# EAGLE design Callisto_Header_Test_Board (EAGLE 9.6.2)
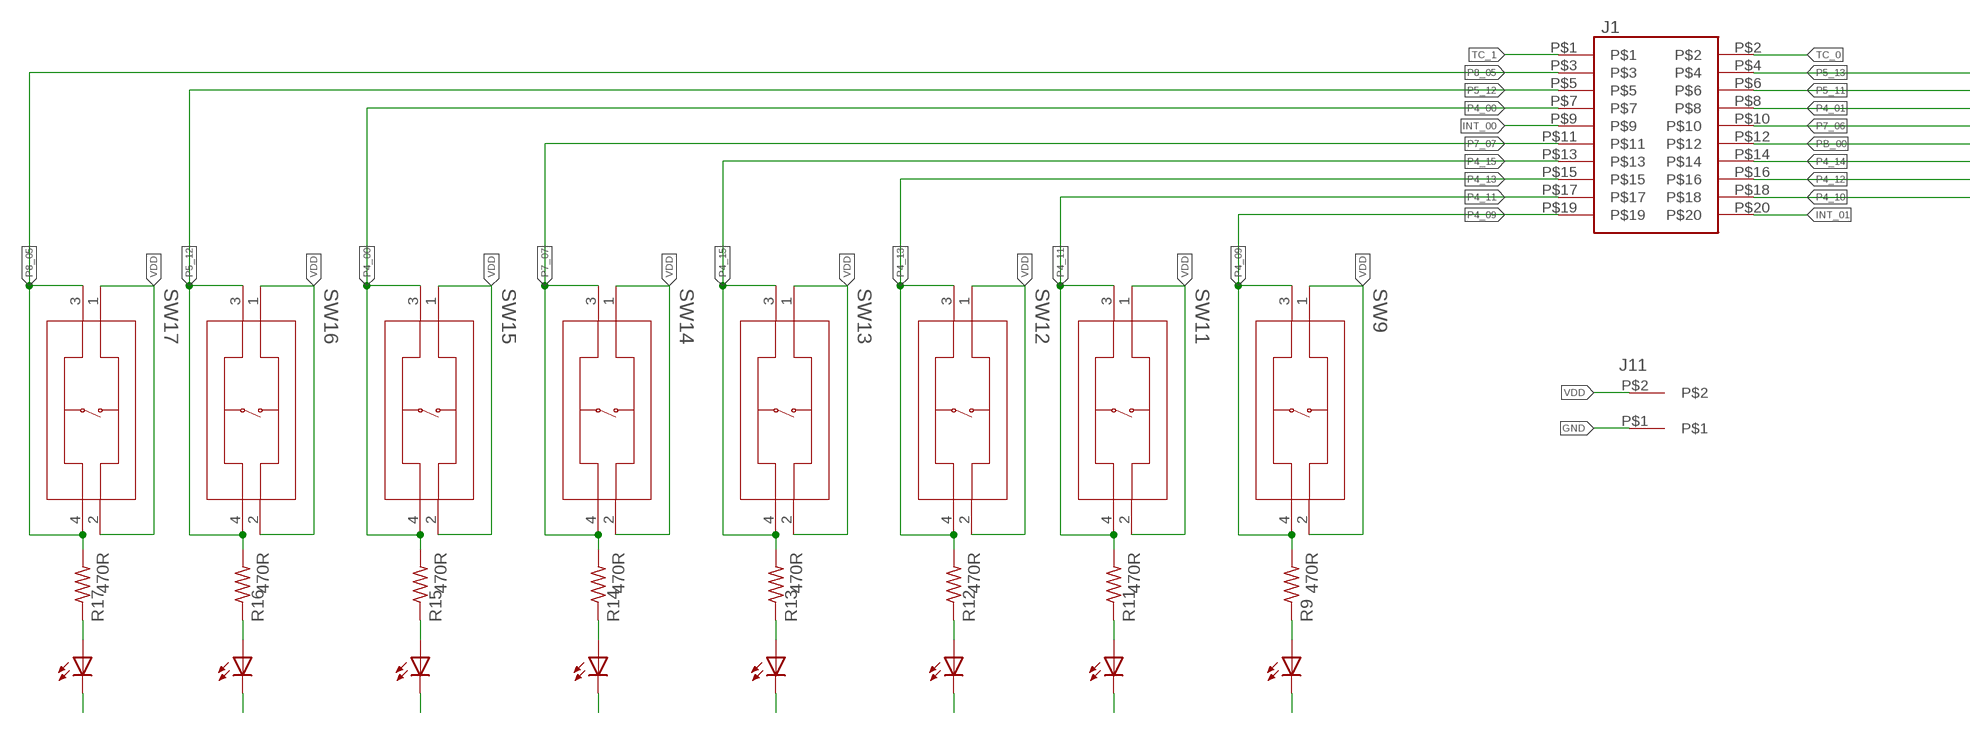
[diagram p0: schematic, sheet 1, part 1 of 2]
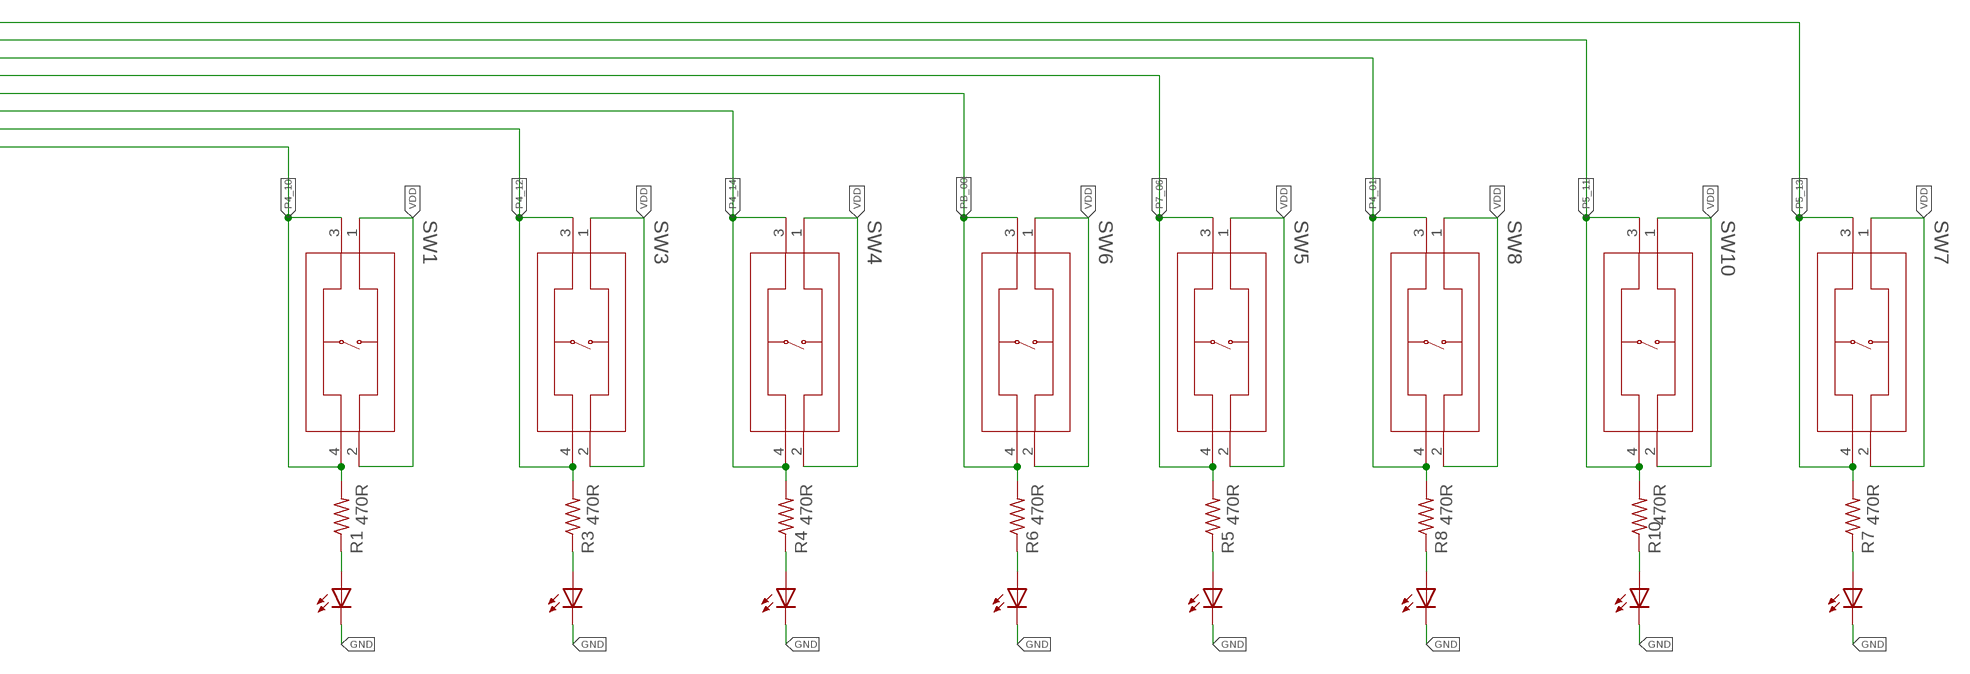
[diagram p1: schematic, sheet 1, part 2 of 2]

## Parts
J1  20-pos  2_X_10_HEADER_GENERIC  [2_X_10_.1_INCH]
J11  2-pos  3.81MM_1_X_2_RT_ANGLE_PLUG_HEADER  [2_3.81MM_PITCH]
LED1  Green  LED_0805_GREEN  [0805]
LED3  Green  LED_0805_GREEN  [0805]
LED4  Green  LED_0805_GREEN  [0805]
LED5  Green  LED_0805_GREEN  [0805]
LED6  Green  LED_0805_GREEN  [0805]
LED7  Green  LED_0805_GREEN  [0805]
LED8  Green  LED_0805_GREEN  [0805]
LED9  Green  LED_0805_GREEN  [0805]
LED10  Green  LED_0805_GREEN  [0805]
LED11  Green  LED_0805_GREEN  [0805]
LED12  Green  LED_0805_GREEN  [0805]
LED13  Green  LED_0805_GREEN  [0805]
LED14  Green  LED_0805_GREEN  [0805]
LED15  Green  LED_0805_GREEN  [0805]
LED16  Green  LED_0805_GREEN  [0805]
LED17  Green  LED_0805_GREEN  [0805]
R1  470R  R_0402  [0402]
R3  470R  R_0402  [0402]
R4  470R  R_0402  [0402]
R5  470R  R_0402  [0402]
R6  470R  R_0402  [0402]
R7  470R  R_0402  [0402]
R8  470R  R_0402  [0402]
R9  470R  R_0402  [0402]
R10  470R  R_0402  [0402]
R11  470R  R_0402  [0402]
R12  470R  R_0402  [0402]
R13  470R  R_0402  [0402]
R14  470R  R_0402  [0402]
R15  470R  R_0402  [0402]
R16  470R  R_0402  [0402]
R17  470R  R_0402  [0402]
SW1  PTS810SJG250SMTRLFS  [PTS810]
SW3  PTS810SJG250SMTRLFS  [PTS810]
SW4  PTS810SJG250SMTRLFS  [PTS810]
SW5  PTS810SJG250SMTRLFS  [PTS810]
SW6  PTS810SJG250SMTRLFS  [PTS810]
SW7  PTS810SJG250SMTRLFS  [PTS810]
SW8  PTS810SJG250SMTRLFS  [PTS810]
SW9  PTS810SJG250SMTRLFS  [PTS810]
SW10  PTS810SJG250SMTRLFS  [PTS810]
SW11  PTS810SJG250SMTRLFS  [PTS810]
SW12  PTS810SJG250SMTRLFS  [PTS810]
SW13  PTS810SJG250SMTRLFS  [PTS810]
SW14  PTS810SJG250SMTRLFS  [PTS810]
SW15  PTS810SJG250SMTRLFS  [PTS810]
SW16  PTS810SJG250SMTRLFS  [PTS810]
SW17  PTS810SJG250SMTRLFS  [PTS810]

## Nets
GND: J11.P$1 LED1.2(C) LED3.2(C) LED4.2(C) LED5.2(C) LED6.2(C) LED7.2(C) LED8.2(C) LED9.2(C) LED10.2(C) LED11.2(C) LED12.2(C) LED13.2(C) LED14.2(C) LED15.2(C) LED16.2(C) LED17.2(C)
INT_00: J1.P$9
INT_01: J1.P$20
N$1: LED1.1(A) R1.P$1
N$3: LED3.1(A) R3.P$1
N$4: LED4.1(A) R4.P$1
N$5: LED5.1(A) R5.P$1
N$6: LED6.1(A) R6.P$1
N$7: LED7.1(A) R7.P$1
N$8: LED8.1(A) R8.P$1
N$9: LED9.1(A) R9.P$1
N$10: LED10.1(A) R10.P$1
N$11: LED11.1(A) R11.P$1
N$12: LED12.1(A) R12.P$1
N$13: LED13.1(A) R13.P$1
N$14: LED14.1(A) R14.P$1
N$15: LED15.1(A) R15.P$1
N$16: LED16.1(A) R16.P$1
N$17: LED17.1(A) R17.P$1
P4_00: J1.P$7 R15.P$2 SW15.3 SW15.4
P4_01: J1.P$8 R8.P$2 SW8.3 SW8.4
P4_09: J1.P$19 R9.P$2 SW9.3 SW9.4
P4_10: J1.P$18 R1.P$2 SW1.3 SW1.4
P4_11: J1.P$17 R11.P$2 SW11.3 SW11.4
P4_12: J1.P$16 R3.P$2 SW3.3 SW3.4
P4_13: J1.P$15 R12.P$2 SW12.3 SW12.4
P4_14: J1.P$14 R4.P$2 SW4.3 SW4.4
P4_15: J1.P$13 R13.P$2 SW13.3 SW13.4
P5_11: J1.P$6 R10.P$2 SW10.3 SW10.4
P5_12: J1.P$5 R16.P$2 SW16.3 SW16.4
P5_13: J1.P$4 R7.P$2 SW7.3 SW7.4
P7_06: J1.P$10 R5.P$2 SW5.3 SW5.4
P7_07: J1.P$11 R14.P$2 SW14.3 SW14.4
P8_05: J1.P$3 R17.P$2 SW17.3 SW17.4
PB_00: J1.P$12 R6.P$2 SW6.3 SW6.4
TC_0: J1.P$2
TC_1: J1.P$1
VDD: J11.P$2 SW1.1 SW1.2 SW3.1 SW3.2 SW4.1 SW4.2 SW5.1 SW5.2 SW6.1 SW6.2 SW7.1 SW7.2 SW8.1 SW8.2 SW9.1 SW9.2 SW10.1 SW10.2 SW11.1 SW11.2 SW12.1 SW12.2 SW13.1 SW13.2 SW14.1 SW14.2 SW15.1 SW15.2 SW16.1 SW16.2 SW17.1 SW17.2

## Library data of the parts
J1 = 3D_MIG_Controller:2_X_10_HEADER_GENERIC: CONN HEADER R/A 20POS 2.54MM, Straight, Right Angle; PARTNO: 67996-420HLF
J11 = 3D_MIG_Controller:3.81MM_1_X_2_RT_ANGLE_PLUG_HEADER: TERM BLOCK HDR 2POS 90DEG 3.81MM; PARTNO: 691322310002
LED1 LED3-LED17 = 3D_MIG_Controller:LED_0805_GREEN: Green 570nm LED Indication - Discrete 2.2V 0805 (2012 Metric); PARTNO: LG R971-KN-1
R1 R3-R17 = 3D_MIG_Controller:R_0402
SW1 SW3-SW17 = 3D_MIG_Controller:PTS810SJG250SMTRLFS; BUILT_BY: EMA_Cory; COPYRIGHT: Copyright (C) 2018 Accelerated Designs. All rights reserved; DATASHEET: https://www.ckswitches.com/products/tactile/PTS810/#PTS810SJG250SMTRLFS; MANUFACTURER_PART_NUMBER: PTS810SJG250SMTRLFS; VENDOR: C&K

## Board
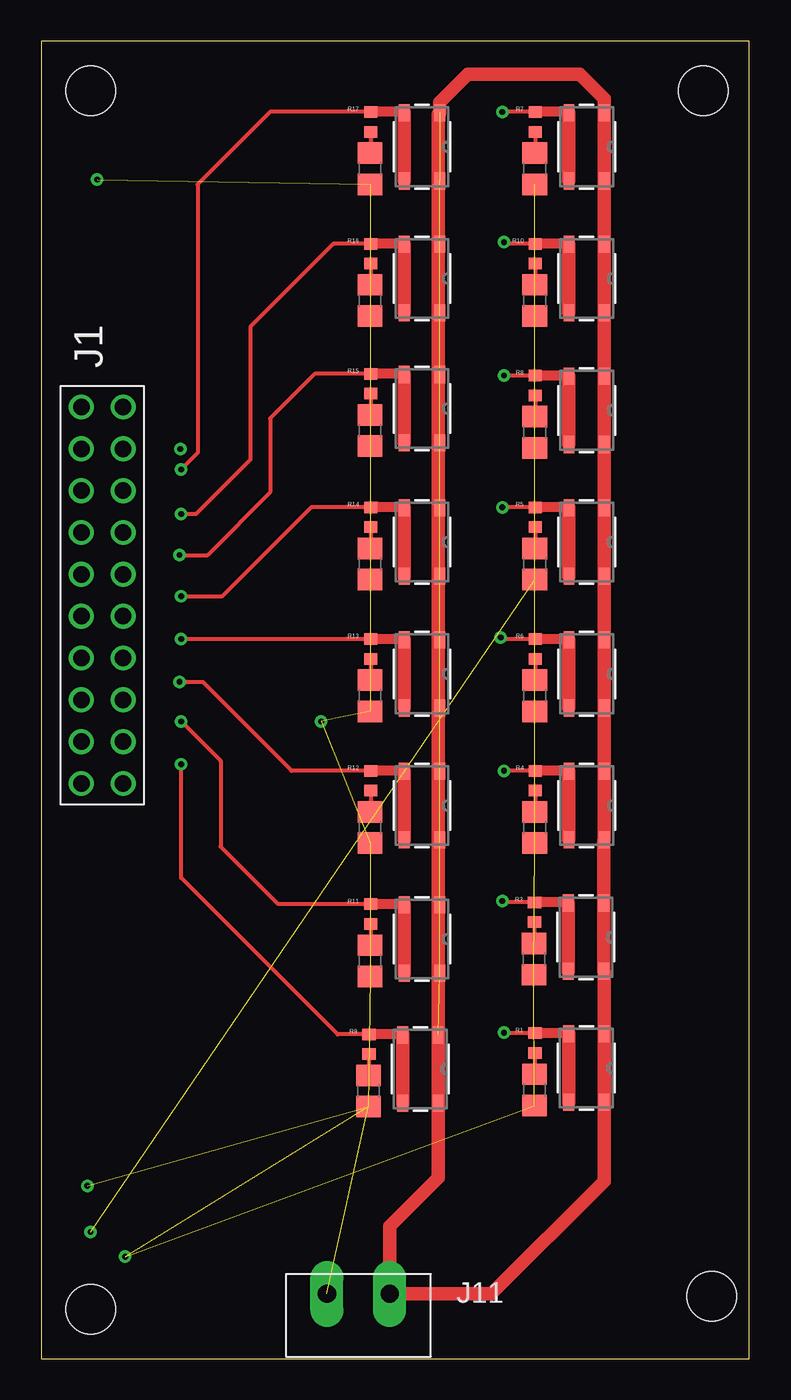
[diagram p2: board, top side]
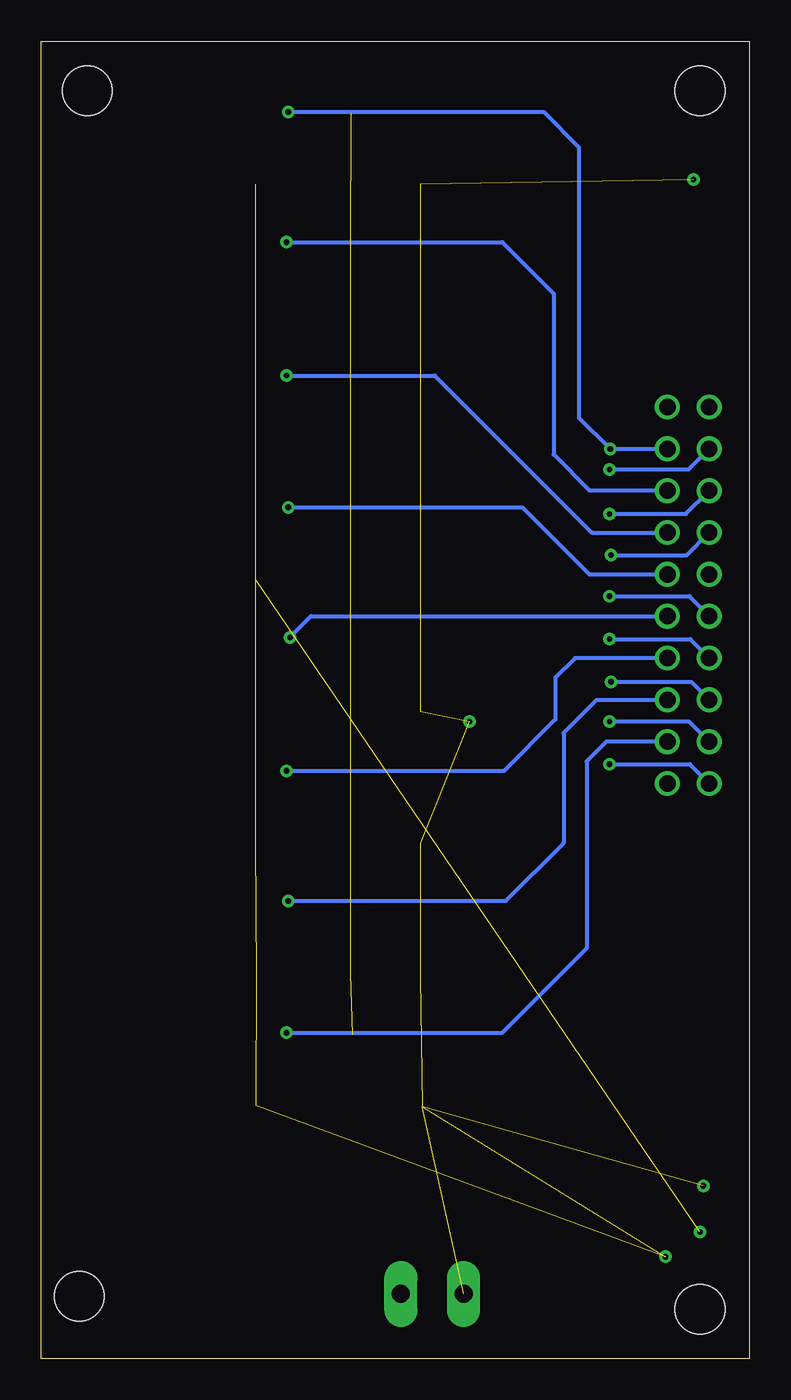
[diagram p3: board, bottom side, seen from below]

Size 43 x 80 mm. Coordinates in mm from the lower left corner, seen from the top.
Outline: 0,0 43,0 43,80 0,80 0,0
Copper layers (1*16): Top 0.035mm / dielectric 1.5mm / Bottom 0.035mm
Design rules "default": minimum track width 6mil, minimum drill 0.35mm, track to track 6mil, track to pad 6mil, pad to pad 6mil, via to via 6mil, smd to smd 6mil, copper to edge 40mil, drill to drill 6mil, minimum pad ring 10mil, minimum via ring 8mil, stop-mask expansion 4mil, vias tented up to drill 0mil, thermal gap 10mil
Holes 3 mm at 3,3 40.7,3.8 3,77 40.2,77

### Footprints (pad centres in the part's own frame; a part is rotated, then mirrored left to right if it is on the bottom)
2_X_10_.1_INCH = drill 1: P$1 -11.43,-1.27; P$2 -11.43,1.27; P$3 -8.89,-1.27; P$4 -8.89,1.27; P$5 -6.35,-1.27; P$6 -6.35,1.27; P$7 -3.81,-1.27; P$8 -3.81,1.27; P$9 -1.27,-1.27; P$10 -1.27,1.27; P$11 1.27,-1.27; P$12 1.27,1.27; P$13 3.81,-1.27; P$14 3.81,1.27; P$15 6.35,-1.27; P$16 6.35,1.27; P$17 8.89,-1.27; P$18 8.89,1.27; P$19 11.43,-1.27; P$20 11.43,1.27
2_3.81MM_PITCH = drill 1.1 pad 2 long: P$1 0,0; P$2 3.81,0
0805 = smd 1.3 x 1.5: 1 -0.95,0; 2 0.95,0
0402 = smd 0.8 x 0.7: P$1 0,0.6; P$2 0,-0.6
PTS810 = smd 1.041 x 0.66: 1 -2.075,1.075; 2 2.075,1.075; 3 -2.075,-1.075; 4 2.075,-1.075

### Placement (x,y rotation side)
J1  3.71,46.36 270 top
J11  17.35,3.94 0 top
LED1  29.95,16.33 270 top
LED3  29.92,24.27 270 top
LED4  29.97,32.26 270 top
LED5  29.97,48.26 270 top
LED6  29.97,40.26 270 top
LED7  29.97,72.26 270 top
LED8  29.97,56.26 270 top
LED9  19.87,16.26 270 top
LED10  29.97,64.26 270 top
LED11  19.97,24.16 270 top
LED12  19.97,32.26 270 top
LED13  19.97,40.26 270 top
LED14  19.97,48.26 270 top
LED15  19.97,56.36 270 top
LED16  19.97,64.26 270 top
LED17  19.97,72.26 270 top
R1  29.98,19.17 180 top
R3  29.95,27.11 180 top
R4  30,35.1 180 top
R5  30,51.1 180 top
R6  30,43.1 180 top
R7  30,75.1 180 top
R8  30,59.1 180 top
R9  19.9,19.1 180 top
R10  30,67.1 180 top
R11  20,27 180 top
R12  20,35.1 180 top
R13  20,43.1 180 top
R14  20,51.1 180 top
R15  20,59.2 180 top
R16  20,67.1 180 top
R17  20,75.1 180 top
SW1  33.1,17.66 270 top
SW3  33.07,25.6 270 top
SW4  33.12,33.59 270 top
SW5  33.12,49.59 270 top
SW6  33.12,41.59 270 top
SW7  33.12,73.59 270 top
SW8  33.12,57.59 270 top
SW9  23.02,17.59 270 top
SW10  33.12,65.59 270 top
SW11  23.12,25.49 270 top
SW12  23.12,33.59 270 top
SW13  23.12,41.59 270 top
SW14  23.12,49.59 270 top
SW15  23.12,57.69 270 top
SW16  23.12,65.59 270 top
SW17  23.12,73.59 270 top

### Tracks (layer width: path | path; a pad name or v marks a point on that pad's centre or on a via)
GND  (via drill 0.35)  (21 unrouted)
  other vias: 3.4,71.6 3,7.7 17,38.7 2.8,10.5 5.1,6.2
N$1
  Top 0.254: R1.P$1 29.98,17.31 LED1.1
N$3
  Top 0.254: R3.P$1 29.95,25.25 LED3.1
N$4
  Top 0.254: R4.P$1 30,33.24 LED4.1
N$5
  Top 0.254: R5.P$1 30,49.24 LED5.1
N$6
  Top 0.254: R6.P$1 30,41.24 LED6.1
N$7
  Top 0.254: R7.P$1 30,73.24 LED7.1
N$8
  Top 0.254: R8.P$1 30,57.24 LED8.1
N$9
  Top 0.254: R9.P$1 19.9,17.24 LED9.1
N$10
  Top 0.254: R10.P$1 30,65.24 LED10.1
N$11
  Top 0.254: R11.P$1 20,25.14 LED11.1
N$12
  Top 0.254: R12.P$1 20,33.24 LED12.1
N$13
  Top 0.254: R13.P$1 20,41.24 LED13.1
N$14
  Top 0.254: R14.P$1 20,49.24 LED14.1
N$15
  Top 0.254: R15.P$1 20,57.34 LED15.1
N$16
  Top 0.254: R16.P$1 20,65.24 LED16.1
N$17
  Top 0.254: R17.P$1 20,73.24 LED17.1
P4_00  (via drill 0.35)
  Top 0.254: R15.P$2 16.6,59.8 13.9,57.1 13.9,52.6 10.1,48.8 v8.4,48.8
  Top 0.61: SW15.3 22.01,59.8 R15.P$2
  Top 0.813: SW15.4 SW15.3
  Bottom 0.254: v8.4,48.8 3.81,48.8 J1.P$7
P4_01  (via drill 0.35)
  Top 0.254: R8.P$2 v28.1,59.7
  Top 0.61: SW8.3 32.01,59.7 R8.P$2
  Top 0.813: SW8.4 SW8.3
  Bottom 0.254: J1.P$8 9.56,50.16 19.1,59.7 v28.1,59.7
P4_09  (via drill 0.35)
  Top 0.254: R9.P$2 18,19.7 8.5,29.2 v8.5,36.1
  Top 0.61: SW9.3 21.91,19.7 R9.P$2
  Top 0.813: SW9.4 SW9.3
  Bottom 0.254: v8.5,36.1 3.61,36.1 J1.P$19
P4_10  (via drill 0.35)
  Top 0.254: R1.P$2 28.13,19.77 v28.1,19.8
  Top 0.61: SW1.3 31.99,19.77 R1.P$2
  Top 0.813: SW1.4 SW1.3
  Bottom 0.254: v28.1,19.8 15,19.8 9.88,24.92 9.88,36.27 8.68,37.47 J1.P$18
P4_11  (via drill 0.35)
  Top 0.254: R11.P$2 14.4,27.6 10.9,31.1 10.9,36.3 v8.5,38.7
  Top 0.61: SW11.3 22.01,27.6 R11.P$2
  Top 0.813: SW11.4 SW11.3
  Bottom 0.254: v8.5,38.7 3.67,38.7 J1.P$17
P4_12  (via drill 0.35)
  Top 0.254: R3.P$2 28.09,27.71 v28,27.8
  Top 0.61: SW3.3 31.96,27.71 R3.P$2
  Top 0.813: SW3.4 SW3.3
  Bottom 0.254: v28,27.8 14.79,27.8 11.28,31.31 11.28,38.01 9.28,40.01 J1.P$16
P4_13  (via drill 0.35)
  Top 0.254: R12.P$2 15.2,35.7 9.8,41.1 v8.4,41.1
  Top 0.61: SW12.3 22.01,35.7 R12.P$2
  Top 0.813: SW12.4 SW12.3
  Bottom 0.254: v8.4,41.1 3.53,41.1 J1.P$15
P4_14  (via drill 0.35)
  Top 0.254: R4.P$2 v28.1,35.7
  Top 0.61: SW4.3 32.01,35.7 R4.P$2
  Top 0.813: SW4.4 SW4.3
  Bottom 0.254: v28.1,35.7 14.9,35.7 11.78,38.82 11.78,41.35 10.58,42.55 J1.P$14
P4_15  (via drill 0.35)
  Top 0.254: R13.P$2 v8.5,43.7
  Top 0.61: SW13.3 22.01,43.7 R13.P$2
  Top 0.813: SW13.4 SW13.3
  Bottom 0.254: v8.5,43.7 3.59,43.7 J1.P$13
P5_11  (via drill 0.35)
  Top 0.254: R10.P$2 28.2,67.7 v28.1,67.8
  Top 0.61: SW10.3 32.01,67.7 R10.P$2
  Top 0.813: SW10.4 SW10.3
  Bottom 0.254: v28.1,67.8 15,67.8 11.88,64.68 11.88,54.91 9.68,52.71 J1.P$6
P5_12  (via drill 0.35)
  Top 0.254: R16.P$2 17.75,67.7 12.7,62.66 12.7,54.6 9.4,51.3 v8.5,51.3
  Top 0.61: SW16.3 22.01,67.7 R16.P$2
  Top 0.813: SW16.4 SW16.3
  Bottom 0.254: v8.5,51.3 3.85,51.3 J1.P$5
P5_13  (via drill 0.35)
  Top 0.254: R7.P$2 v28,75.7
  Top 0.61: SW7.3 32.01,75.7 R7.P$2
  Top 0.813: SW7.4 SW7.3
  Bottom 0.254: J1.P$4 v8.45,55.24 10.35,57.14 10.35,73.55 12.5,75.7 v28,75.7
P7_06  (via drill 0.35)
  Top 0.254: R5.P$2 v28,51.7
  Top 0.61: SW5.3 32.01,51.7 R5.P$2
  Top 0.813: SW5.4 SW5.3
  Bottom 0.254: J1.P$10 5.08,47.63 5.09,47.62 9.72,47.62 13.8,51.7 v28,51.7
P7_07  (via drill 0.35)
  Top 0.254: R14.P$2 16.4,51.7 11,46.3 v8.5,46.3
  Top 0.61: SW14.3 22.01,51.7 R14.P$2
  Top 0.813: SW14.4 SW14.3
  Bottom 0.254: v8.5,46.3 3.65,46.3 J1.P$11
P8_05  (via drill 0.35)
  Top 0.254: R17.P$2 13.9,75.7 9.5,71.3 9.5,55 v8.5,54
  Top 0.61: SW17.3 22.01,75.7 R17.P$2
  Top 0.813: SW17.4 SW17.3
  Bottom 0.254: v8.5,54 3.69,54 J1.P$3
PB_00  (via drill 0.35)
  Top 0.254: R6.P$2 28,43.7 v27.9,43.8
  Top 0.61: SW6.3 32.01,43.7 R6.P$2
  Top 0.813: SW6.4 SW6.3
  Bottom 0.254: v27.9,43.8 26.6,45.1 26.6,45.09 J1.P$12
VDD  (14 unrouted)
  Top 0.813: SW1.2 SW1.1 34.17,23.5 SW3.2 SW3.1 34.15,31.46 SW4.2 SW4.1 SW6.2 SW6.1 SW5.2 SW5.1 SW8.2 SW8.1 SW10.2 SW10.1 SW7.2 SW7.1 34.2,76.5 32.7,78 25.9,78 24.2,76.3 SW17.1 24.09,75.56 SW9.2 24.09,10.99 21.16,8.06 J11.P$2 27.34,3.94 34.17,10.78 SW1.2